# EasyEDA Pro project My_design_2025-04-12.epro

# Schematic Schematic1
Board Name: Board1; Create Date: 2025-04-12; Page Name: P1; Project Name: Pro1; Schematic Name: Schematic1; Update Date: 2025-04-12; Company: 嘉立创EDA; Page Size: A4; Version: V1.0
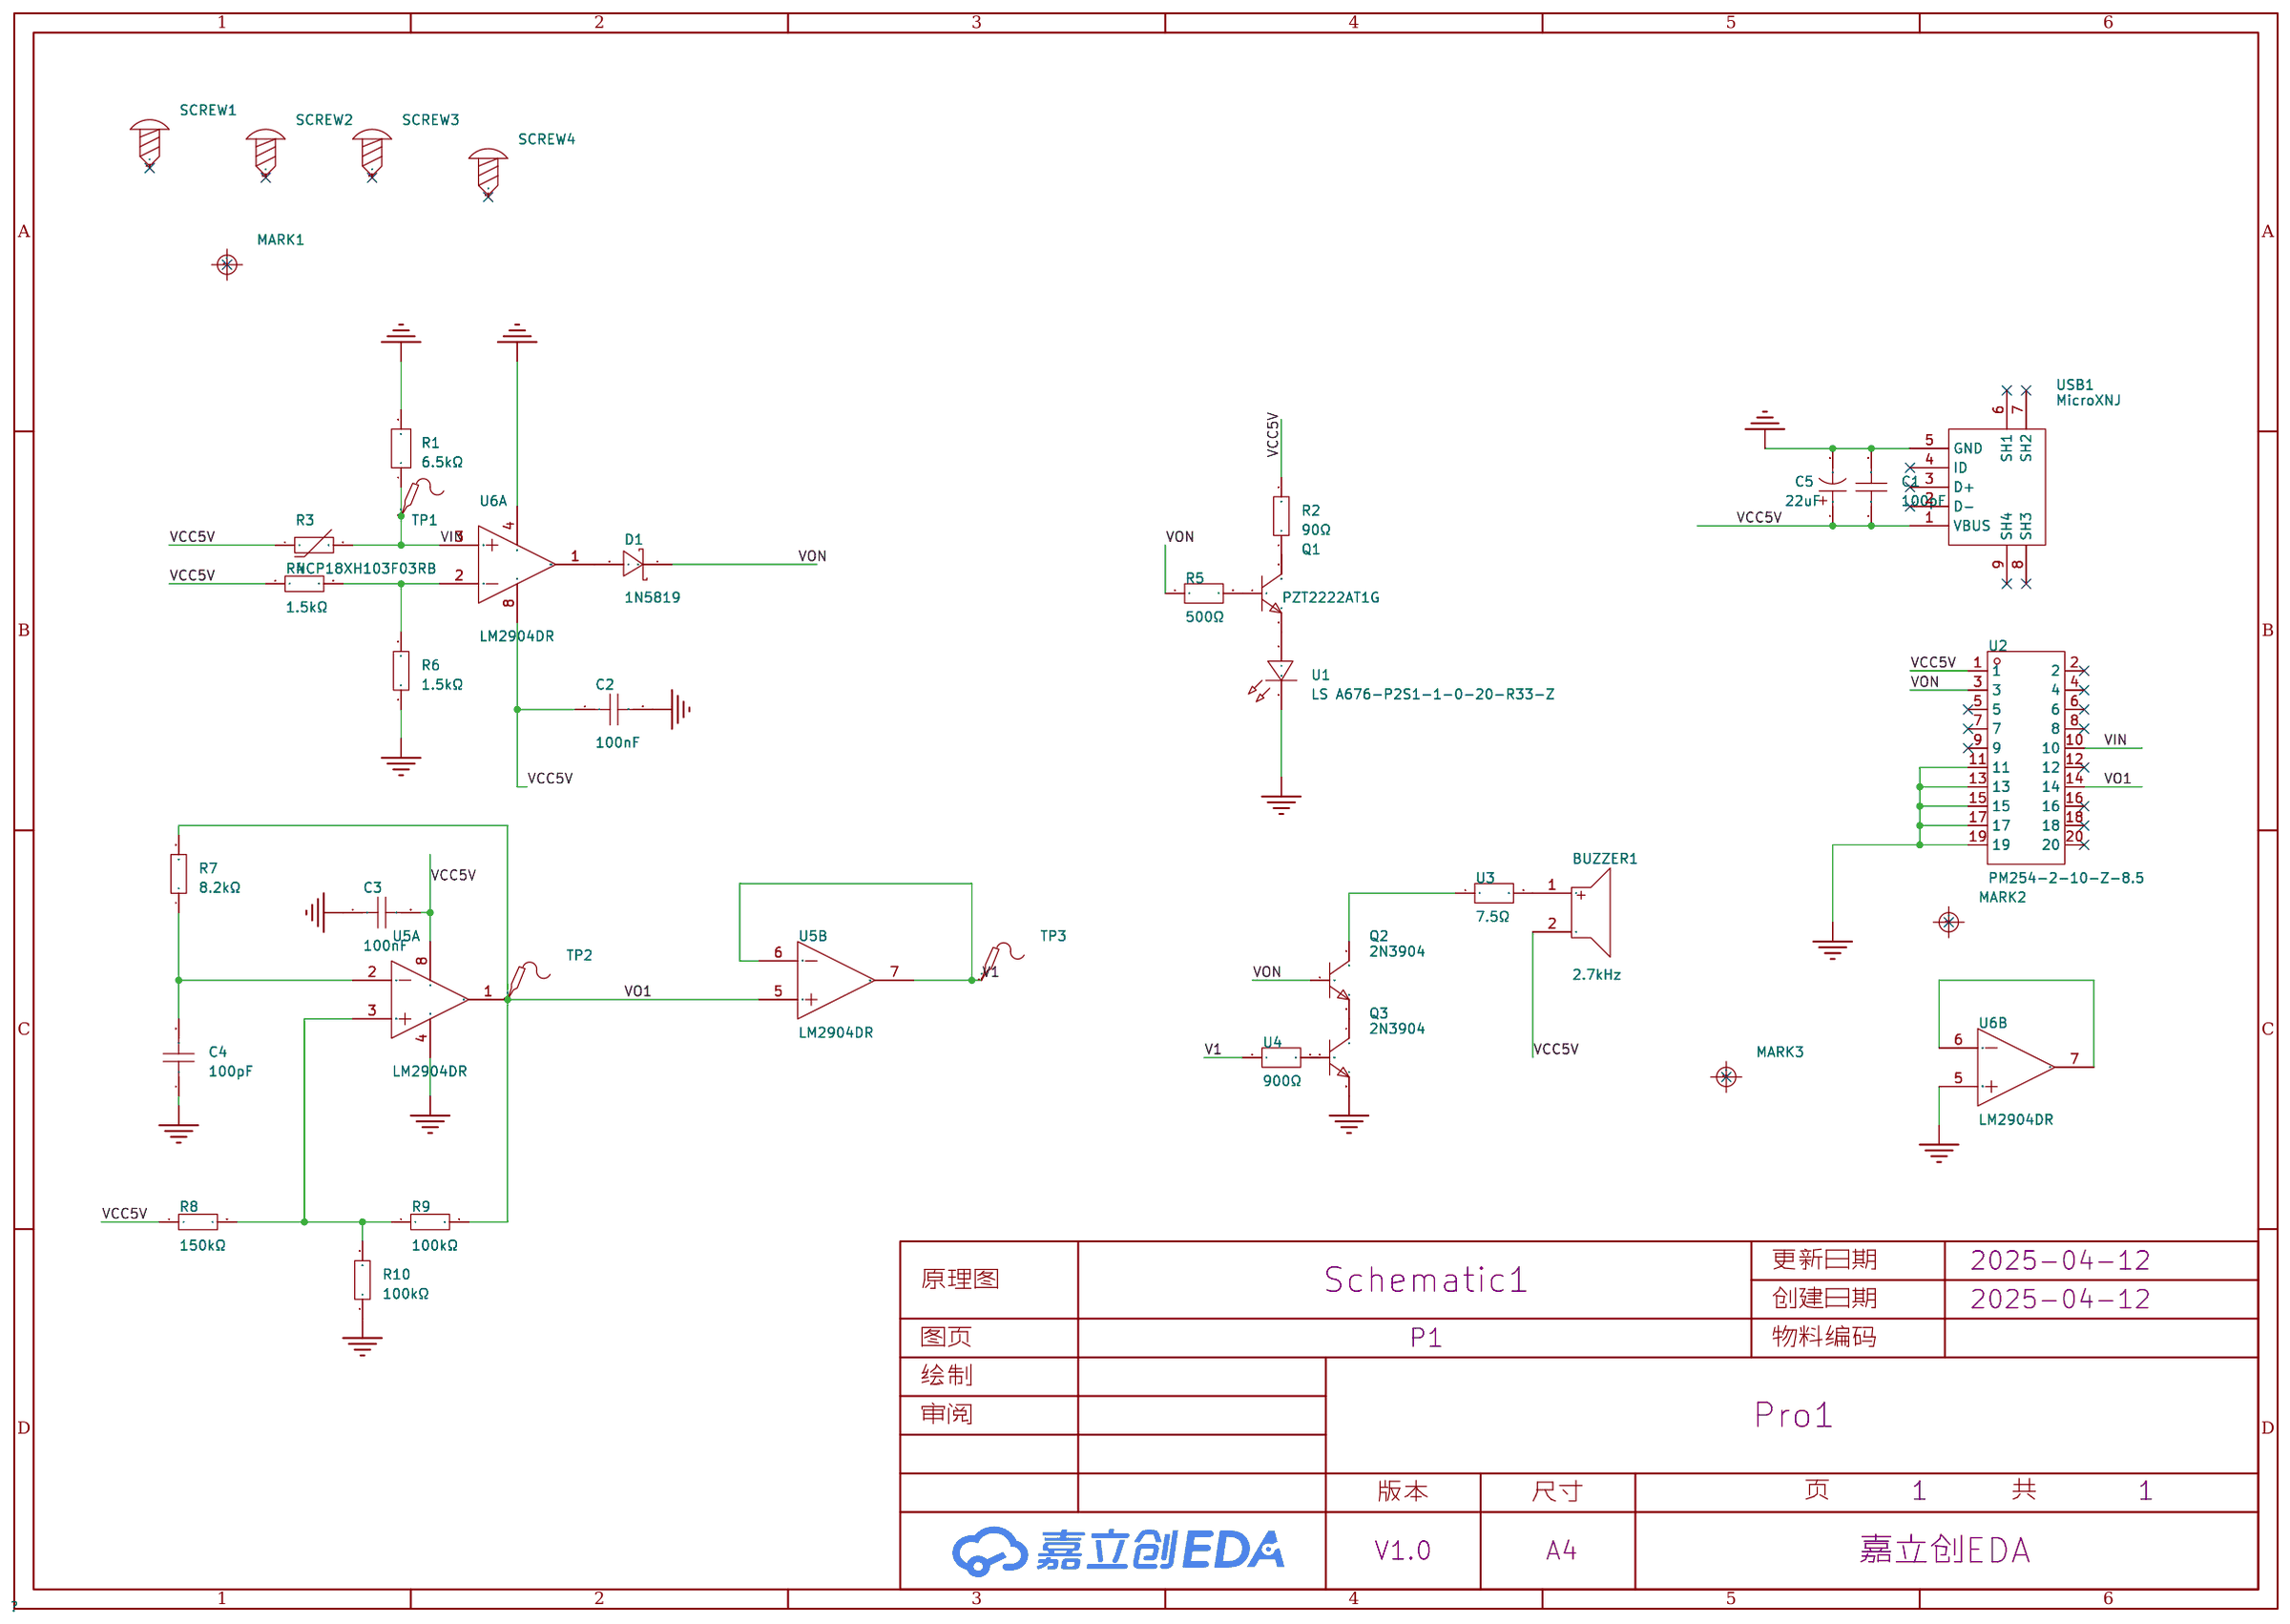
[diagram p0: schematic sheet]

## Parts
BUZZER1  2.7kHz  [BUZ-TH_BD9.0-P4.00-D0.6-FD]
C1  100pF  [C0603]
C2  100nF  [C0603]
C3  100nF  [C0603]
C4  100pF  [C0603]
C5  22uF  [CAP-TH_BD8.0-P5.00-D0.6-FD]
D1  1N5819  [SMA_L4.4-W2.6-LS5.0-RD]
MARK1  -  [Mark-Point-1mm]  (no BOM)
MARK2  -  [Mark-Point-1mm]  (no BOM)
MARK3  -  [Mark-Point-1mm]  (no BOM)
Q1  PZT2222AT1G  [SOT-223_L6.5-W3.5-P2.30-LS7.0-BR]
Q2  2N3904  [TO-92-3_L4.6-W3.6-P1.27-L_1]
Q3  2N3904  [TO-92-3_L4.6-W3.6-P1.27-L_1]
R1  6.5kΩ  [R0603]
R2  90Ω  [R0805]
R3  NCP18XH103F03RB  [R0603]
R4  1.5kΩ  [R0603]
R5  500Ω  [R0805]
R6  1.5kΩ  [R0603]
R7  8.2kΩ  [R0603]
R8  150kΩ  [R0603]
R9  100kΩ  [R0603]
R10  100kΩ  [R0603]
SCREW1  -  [M3螺丝]
SCREW2  -  [M3螺丝]
SCREW3  -  [M3螺丝]
SCREW4  -  [M3螺丝]
TP1  -  [Test-Point-0.5mm]
TP2  -  [Test-Point-0.5mm]
TP3  -  [Test-Point-0.5mm]
U1  LS A676-P2S1-1-0-20-R33-Z  [LED-SMD_L4.0-W3.6-P2.54-RD]
U2  PM254-2-10-Z-8.5  [HDR-TH_20P-P2.54-V-F-R2-C10-S2.54]
U3  7.5Ω  [R1206]
U4  900Ω  [R0805]
U5  LM2904DR  [SOIC-8_L4.9-W3.9-P1.27-LS6.0-BL]  (sections 1,2)
U6  LM2904DR  [SOIC-8_L4.9-W3.9-P1.27-LS6.0-BL]  (sections 1,2)
USB1  MicroXNJ  [MICRO-USB-SMD_MICROXNJ]

## Library data of the parts
BUZZER1 = QMB-09B-03: 驱动方式:无源(外部驱动);构造类型:电磁式;频率:2.7kHz;声压(SPL):85dB@3V,10cm;; LCSC Part Name: 无源蜂鸣器QMB-09B-03; Supplier Part: C96256; Manufacturer: 华能; Supplier Footprint: 插件,D=9mm; JLCPCB Part Class: 扩展库; Datasheet: https://atta.szlcsc.com/upload/public/pdf/source/20210401/C96256_958B17753B5AD7CBFBCFFC7C095B4484.pdf; Supplier: LCSC; Oscillator Circuit: 无源(外部驱动); Technology Type: 电磁式; Operating Voltage: 2V~5V; Sound Pressure Level (SPL): 85dB@3V,10cm; Diameter (φD): 9mm; Height: 5.7mm; Check: true
C1 C4 = CC0603JRNPO9BN101: 容值:100pF;精度:±5%;额定电压:50V;材质(温度系数):NP0;; LCSC Part Name: 100pF ±5% 50V; Supplier Part: C14665; Manufacturer: YAGEO(国巨); Supplier Footprint: 0603; JLCPCB Part Class: 扩展库; Datasheet: https://atta.szlcsc.com/upload/public/pdf/source/20181008/C309499_21CC21451B82C39E3D92150FD6B30293.pdf; Supplier: LCSC; Tolerance: ±5%; Voltage Rated: 50V; Temperature Coefficient: NP0; Check: true
C2 C3 = CC0603KRX7R9BB104: 容值:100nF;精度:±10%;额定电压:50V;材质(温度系数):X7R;; LCSC Part Name: 100nF ±10% 50V; Supplier Part: C14663; Manufacturer: YAGEO(国巨); Supplier Footprint: 0603; JLCPCB Part Class: 基础库; Datasheet: https://atta.szlcsc.com/upload/public/pdf/source/20180910/C282072_33301C7F631E79921B82A8DAC6BCC5B3.pdf; Supplier: LCSC; Tolerance: ±10%; Voltage Rated: 50V; Temperature Coefficient: X7R; Check: true
C5 = CD110226M2G0816VFL: 容值:22uF;额定电压:400V;; LCSC Part Name: 22uF 400V; Supplier Part: C7499973; Manufacturer: HRK(鸿瑞凯); Supplier Footprint: 插件,D8xL16mm; JLCPCB Part Class: 扩展库; Supplier: LCSC; Voltage Rated: 400V; Diameter: 8mm; Height - Seated (Max): 16mm
D1 = 1N5819_C437199: 正向压降(Vf):500mV@1A;直流反向耐压(Vr):40V;平均整流电流(Io):1A;; LCSC Part Name: 电压:40V 电流:1A; Supplier Part: C437199; Manufacturer: KEXIN(科信); Supplier Footprint: DO-214AC(SMA); JLCPCB Part Class: 扩展库; Datasheet: https://atta.szlcsc.com/upload/public/pdf/source/20191012/C437199_83583E622A6684E767605E43C169C596.pdf; Supplier: LCSC; Forward Voltage (Vf@If): 500mV@1A; Reverse Voltage (Vr): 40V; Average Rectified Current (Io): 1A; Check: true
MARK1-MARK3 = Mark-Point: Mark点; Check: true
Q1 = PZT2222AT1G: 晶体管类型:NPN;集电极电流(Ic):600mA;集射极击穿电压(Vceo):40V;功率(Pd):1.5W;直流电流增益(hFE@Ic,Vce):35@150mA,10V;; LCSC Part Name: NPN 电流:600mA 耐压:40V; Supplier Part: C115272; Manufacturer: onsemi(安森美); Supplier Footprint: SOT-223; JLCPCB Part Class: 扩展库; Datasheet: https://atta.szlcsc.com/upload/public/pdf/source/20181211/C115272_AD826A0F944780AAFC346C3EC86126BD.pdf; Supplier: LCSC; Transistor Type: NPN; Collector Current (Ic): 600mA; Collector-Emitter Breakdown Voltage (Vceo): 40V; Power Dissipation (Pd): 1.5W; DC Current Gain (hFE@Ic,Vce): 35@150mA,10V; Transition Frequency (fT): 300MHz; Collector Cut-Off Current (Icbo): 10nA; Collector-Emitter Saturation Voltage (VCE(sat)@Ic,Ib): 300mV@150mA,15mA; Operating Temperature: -55℃~+150℃
Q2 Q3 = 2N3904_C2874602: 晶体管类型:NPN;集电极电流(Ic):200mA;集射极击穿电压(Vceo):40V;功率(Pd):625mW;直流电流增益(hFE@Ic,Vce):10@10mA,1V;; LCSC Part Name: NPN 电流:200mA 耐压:40V; Supplier Part: C2874602; Manufacturer: JSMSEMI(杰盛微); Supplier Footprint: TO-92-3; JLCPCB Part Class: 扩展库; Datasheet: https://atta.szlcsc.com/upload/public/pdf/source/20240219/A8966BBAAB08D1F2F4DA71E9452FFE5E.pdf; Supplier: LCSC; Transistor Type: NPN; Collector Current (Ic): 200mA; Collector-Emitter Breakdown Voltage (Vceo): 40V; Power Dissipation (Pd): 625mW; DC Current Gain (hFE@Ic,Vce): 10@10mA,1V; Collector Cut-Off Current (Icbo): 100nA; Collector-Emitter Saturation Voltage (VCE(sat)@Ic,Ib): 300mV; Operating Temperature: -55℃~+150℃
R1 = MCT06030D6501BP100: 电阻类型:薄膜电阻;阻值:6.5kΩ;精度:±0.1%;功率:100mW;最大工作电压:75V;温度系数:±25ppm/℃;; LCSC Part Name: 薄膜电阻 6.5kΩ ±0.1% 100mW; Supplier Part: C1707189; Manufacturer: VISHAY(威世); Supplier Footprint: 0603; JLCPCB Part Class: 扩展库; Datasheet: https://atta.szlcsc.com/upload/public/pdf/source/20210426/0BE53C245AFBBB1DABBADD6CC4094FB0.pdf; Supplier: LCSC; Type: 薄膜电阻; Tolerance: ±0.1%; Power(Watts): 100mW; Overload Voltage (Max): 75V; Temperature Coefficient: ±25ppm/℃; Operating Temperature Range: -55℃~+125℃; Check: true
R2 = RS-05K90R0FT: 电阻类型:厚膜电阻;阻值:90Ω;精度:±1%;功率:125mW;最大工作电压:150V;温度系数:±100ppm/℃;; LCSC Part Name: 厚膜电阻 90Ω ±1% 125mW; Supplier Part: C320576; Manufacturer: FH(风华); Supplier Footprint: 0805; JLCPCB Part Class: 扩展库; Datasheet: https://atta.szlcsc.com/upload/public/pdf/source/20140616/1457707091974.pdf; Supplier: LCSC; Type: 厚膜电阻; Tolerance: ±1%; Power(Watts): 125mW; Overload Voltage (Max): 150V; Temperature Coefficient: ±100ppm/℃; Operating Temperature Range: -55℃~+155℃; Check: true
R3 = NCP18XH103F03RB: 阻值(25℃):10kΩ;B值(25℃/50℃):3380K;电阻精度:±1%;功率:100mW;B值精度:±1%;最大稳态电流(25℃):310uA;; LCSC Part Name: 10kΩ 电阻精度:±1% 3380K; Supplier Part: C13564; Manufacturer: muRata(村田); Supplier Footprint: 0603; JLCPCB Part Class: 扩展库; Datasheet: https://atta.szlcsc.com/upload/public/pdf/source/20130819/1457706638081.pdf; Supplier: LCSC; Resistance @ 25℃: 10kΩ; B Constant (25℃/50℃): 3380K; Resistance Tolerance: ±1%; B Constant (25℃/85℃): 3434K; B Constant (25℃/100℃): 3455K; Power: 100mW; B Constant Tolerance: ±1%; Steady State Current (Max): 310uA; Operating Temperature: -40℃~+125℃; Check: true
R4 R6 = 0603WAF1501T5E: 电阻类型:厚膜电阻;阻值:1.5kΩ;精度:±1%;功率:100mW;最大工作电压:75V;温度系数:±100ppm/℃;; LCSC Part Name: 1.5kΩ ±1% 100mW 厚膜电阻; Supplier Part: C22843; Manufacturer: UNI-ROYAL(厚声); Supplier Footprint: 0603; JLCPCB Part Class: 基础库; Datasheet: https://atta.szlcsc.com/upload/public/pdf/source/20200306/C422600_1E6D84923E4A46A82E41ADD87F860B5C.pdf; Supplier: LCSC; Type: 厚膜电阻; Tolerance: ±1%; Power(Watts): 100mW; Overload Voltage (Max): 75V; Temperature Coefficient: ±100ppm/℃; Operating Temperature Range: -55℃~+155℃; Check: true
R5 = ARG05FTC5000: 电阻类型:薄膜电阻;阻值:500Ω;精度:±1%;功率:125mW;最大工作电压:150V;温度系数:±25ppm/℃;; LCSC Part Name: 薄膜电阻 500Ω ±1% 125mW; Supplier Part: C2828857; Manufacturer: Viking(光颉); Supplier Footprint: 0805; JLCPCB Part Class: 扩展库; Datasheet: https://atta.szlcsc.com/upload/public/pdf/source/20210426/C2828737_35D2DDB0BDDA00747C2712435E28BBD4.pdf; Supplier: LCSC; Type: 薄膜电阻; Tolerance: ±1%; Power(Watts): 125mW; Overload Voltage (Max): 150V; Temperature Coefficient: ±25ppm/℃; Operating Temperature Range: -55℃~+155℃; Check: true
R7 = 0603WAF8201T5E: 电阻类型:厚膜电阻;阻值:8.2kΩ;精度:±1%;功率:100mW;最大工作电压:75V;温度系数:±100ppm/℃;; LCSC Part Name: 8.2kΩ ±1% 100mW 厚膜电阻; Supplier Part: C25981; Manufacturer: UNI-ROYAL(厚声); Supplier Footprint: 0603; JLCPCB Part Class: 基础库; Datasheet: https://atta.szlcsc.com/upload/public/pdf/source/20200306/C422600_1E6D84923E4A46A82E41ADD87F860B5C.pdf; Supplier: LCSC; Type: 厚膜电阻; Tolerance: ±1%; Power(Watts): 100mW; Overload Voltage (Max): 75V; Temperature Coefficient: ±100ppm/℃; Operating Temperature Range: -55℃~+155℃; Check: true
R8 = 0603WAF1503T5E: 电阻类型:厚膜电阻;阻值:150kΩ;精度:±1%;功率:100mW;最大工作电压:75V;温度系数:±100ppm/℃;; LCSC Part Name: 150kΩ ±1% 100mW 厚膜电阻; Supplier Part: C22807; Manufacturer: UNI-ROYAL(厚声); Supplier Footprint: 0603; JLCPCB Part Class: 基础库; Datasheet: https://atta.szlcsc.com/upload/public/pdf/source/20200306/C422600_1E6D84923E4A46A82E41ADD87F860B5C.pdf; Supplier: LCSC; Type: 厚膜电阻; Tolerance: ±1%; Power(Watts): 100mW; Overload Voltage (Max): 75V; Temperature Coefficient: ±100ppm/℃; Operating Temperature Range: -55℃~+155℃; Check: true
R9 R10 = 0603WAF1003T5E: 电阻类型:厚膜电阻;阻值:100kΩ;精度:±1%;功率:100mW;最大工作电压:75V;温度系数:±100ppm/℃;; LCSC Part Name: 100kΩ ±1% 100mW 厚膜电阻; Supplier Part: C25803; Manufacturer: UNI-ROYAL(厚声); Supplier Footprint: 0603; JLCPCB Part Class: 基础库; Datasheet: https://atta.szlcsc.com/upload/public/pdf/source/20200306/C422600_1E6D84923E4A46A82E41ADD87F860B5C.pdf; Supplier: LCSC; Type: 厚膜电阻; Tolerance: ±1%; Power(Watts): 100mW; Overload Voltage (Max): 75V; Temperature Coefficient: ±100ppm/℃; Operating Temperature Range: -55℃~+155℃; Check: true
SCREW1-SCREW4 = M3螺丝: Supplier Footprint: 插件; Check: true
TP1-TP3 = Test-Point: Test Point 测试点; Check: true
U1 = LS A676-P2S1-1-0-20-R33-Z: 发光颜色:红色;正向电压(VF):2V;功率:-;正向电流:20mA;主波长:633nm;二极管配置:-;透镜颜色:无色透明透镜;色温:-;发光强度:140mcd;发光角度:120°;载带方式:-;工作温度:-40℃~+100℃;; Supplier Part: C2830530; Manufacturer: OSRAM(欧司朗); Supplier Footprint: SMD,3.8x3.8mm; JLCPCB Part Class: 扩展库; Datasheet: https://atta.szlcsc.com/upload/public/pdf/source/20210520/C2830530_E9558D0B09993D0AFAFB2F579C8A98F9.pdf; Supplier: LCSC; Emitted Color: 红色; Forward Voltage (VF): 2V; Forward Current: 20mA; Dominant Wavelength: 633nm; Peak Wavelength: 645nm; Lens Color: 无色透明透镜; Luminous Intensity: 140mcd; Viewing Angle: 120°; Operating Temperature: -40℃~+100℃; Check: true
U2 = PM254-2-10-Z-8.5: 插孔结构:2x10P;间距:2.54mm;行距:2.54mm;圆孔/方孔:方孔;安装类型:直插;排数:双排;总孔位数:20P;额定电流:3A;额定电压:-;插孔方向:顶部;塑高:8.5mm;触头材质:铜合金;工作温度范围:-40℃~+105℃;焊接温度(最大值):260℃@5S;; LCSC Part Name: 2x10P 间距:2.54mm 直插; Supplier Part: C2897411; Manufacturer: HCTL(华灿天禄); Supplier Footprint: 插件,P=2.54mm; JLCPCB Part Class: 扩展库; Datasheet: https://atta.szlcsc.com/upload/public/pdf/source/20230609/3D36CA2C1BFC9FD1C3F709AD9DFEB9C2.pdf; Supplier: LCSC; Holes Structure: 2x10P; Pitch: 2.54mm; Row Spacing: 2.54mm; Circular Hole / Square Hole: 方孔; Mounting Type: 直插; Number of Rows: 双排; Number of Holes: 20P; Current Rating (Max): 3A; Holes Direction: 顶部; Insulation Height: 8.5mm; Contact Material: 铜合金; Operating Temperature Range: -40℃~+105℃; Soldering Temperature(Max): 260℃@5S; Check: true
U3 = FRC1206F7R50TS: 电阻类型:厚膜电阻;阻值:7.5Ω;精度:±1%;功率:250mW;最大工作电压:200V;温度系数:±200ppm/℃;; LCSC Part Name: 7.5Ω ±1% 250mW 厚膜电阻; Supplier Part: C2933756; Manufacturer: FOJAN(富捷); Supplier Footprint: 1206; JLCPCB Part Class: 扩展库; Datasheet: https://atta.szlcsc.com/upload/public/pdf/source/20211221/925EC7D7225764EE0046F22065062C87.pdf; Supplier: LCSC; Type: 厚膜电阻; Tolerance: ±1%; Power(Watts): 250mW; Overload Voltage (Max): 200V; Temperature Coefficient: ±200ppm/℃; Operating Temperature Range: -55℃~+155℃; Check: true
U4 = ARG05BTC9000N: 电阻类型:薄膜电阻;阻值:900Ω;精度:±0.1%;功率:125mW;最大工作电压:150V;温度系数:±25ppm/℃;; LCSC Part Name: 薄膜电阻 900Ω ±0.1% 125mW; Supplier Part: C2828704; Manufacturer: Viking(光颉); Supplier Footprint: 0805; JLCPCB Part Class: 扩展库; Datasheet: https://atta.szlcsc.com/upload/public/pdf/source/20190816/C412422_E173BA386C6DD8245B6A88358EF9877A.pdf; Supplier: LCSC; Type: 薄膜电阻; Tolerance: ±0.1%; Power(Watts): 125mW; Overload Voltage (Max): 150V; Temperature Coefficient: ±25ppm/℃; Operating Temperature Range: -55℃~+155℃; Check: true
U5 U6 = LM2904DR_C7934: 放大器数:双路;增益带宽积(GBP):700kHz;输入偏置电流(Ib):20nA;压摆率(SR):0.3V/us;带宽(-3db):-;; LCSC Part Name: 行业标准双路运算放大器; Supplier Part: C7934; Manufacturer: TI(德州仪器); Supplier Footprint: SOIC-8; JLCPCB Part Class: 扩展库; Datasheet: http://www.ti.com/cn/lit/gpn/lm358; Supplier: LCSC; Number of Circuits: 双路; Gain Bandwidth Product(GBP): 700kHz; Current - Input Bias(Ib): 20nA; Slew Rate(SR): 0.3V/us; Output Current: 40mA; Supply Current: 1mA; Operating Temperature: -40℃~+125℃; Check: true
USB1 = MicroXNJ: 连接器类型:Micro-B;标准:USB 2.0;公母:母;安装方式:卧贴;触点数量:5P;端口数量:1;额定电流 - 电源:1A;工作温度范围:-20℃~+85℃;; LCSC Part Name: Micro-B 母 卧贴; Supplier Part: C404969; Manufacturer: SHOU HAN(首韩); Supplier Footprint: SMD; JLCPCB Part Class: 扩展库; Datasheet: https://atta.szlcsc.com/upload/public/pdf/source/20220415/2494EDFF499AF6F852F7C820374B6AF3.pdf; Supplier: LCSC; Connector Type: Micro-B; Standard: USB 2.0; Gender: 母; Mounting Style: 卧贴; Number of Contacts: 5P; Number of Ports: 1; Current Rating - Power (Max): 1A; Operating Temperature Range: -20℃~+85℃; Check: true

## Nets
GND: C1.2 C2.2 C3.1 C4.1 C5.2 Q3.3(E) R1.2 R6.1 R10.1 U1.1(C) U2.11 U2.13 U2.15 U2.17 U2.19 U5.4(GND) U6.4(GND) U6.5(2IN+) USB1.5(GND)
V1: TP3.1 U4.1 U5.6(2IN-) U5.7(2OUT)
VCC5V: BUZZER1.2 C1.1 C2.1 C3.2 C5.1 R2.2 R3.1 R4.1 R8.1 U2.1 U5.8(VCC) U6.8(VCC) USB1.1(VBUS)
VIN: R1.1 R3.2 TP1.1 U2.10 U6.3(1IN+)
VO1: R7.2 R9.2 TP2.1 U2.14 U5.1(1OUT) U5.5(2IN+)
VON: D1.1(C) Q2.2(B) R5.1 U2.3
Net-(BUZZER1-1): BUZZER1.1 U3.2
Net-(C4-2): C4.2 R7.1 U5.2(1IN-)
Net-(D1-2): D1.2(A) U6.1(1OUT)
Net-(Q1-1): Q1.1(B) R5.2
Net-(Q1-2): Q1.2(C) Q1.4(C) R2.1
Net-(Q1-3): Q1.3(E) U1.2(A)
Net-(Q2-1): Q2.1(C) U3.1
Net-(Q2-3): Q2.3(E) Q3.1(C)
Net-(Q3-2): Q3.2(B) U4.2
Net-(R4-2): R4.2 R6.2 U6.2(1IN-)
Net-(R8-2): R8.2 R9.1 R10.2 U5.3(1IN+)
Net-(U6-6): U6.6(2IN-) U6.7(2OUT)

Not connected (* = marked no-connect by the designer): MARK1 1*; MARK2 1*; MARK3 1*; SCREW1 1*; SCREW2 1*; SCREW3 1*; SCREW4 1*; U2 2* 4* 5* 6* 7* 8* 9* 12* 16* 18* 20*; USB1 2(D-)* 3(D+)* 4(ID)* 6(SH1)* 7(SH2)* 8(SH3)* 9(SH4)*

# Board PCB1
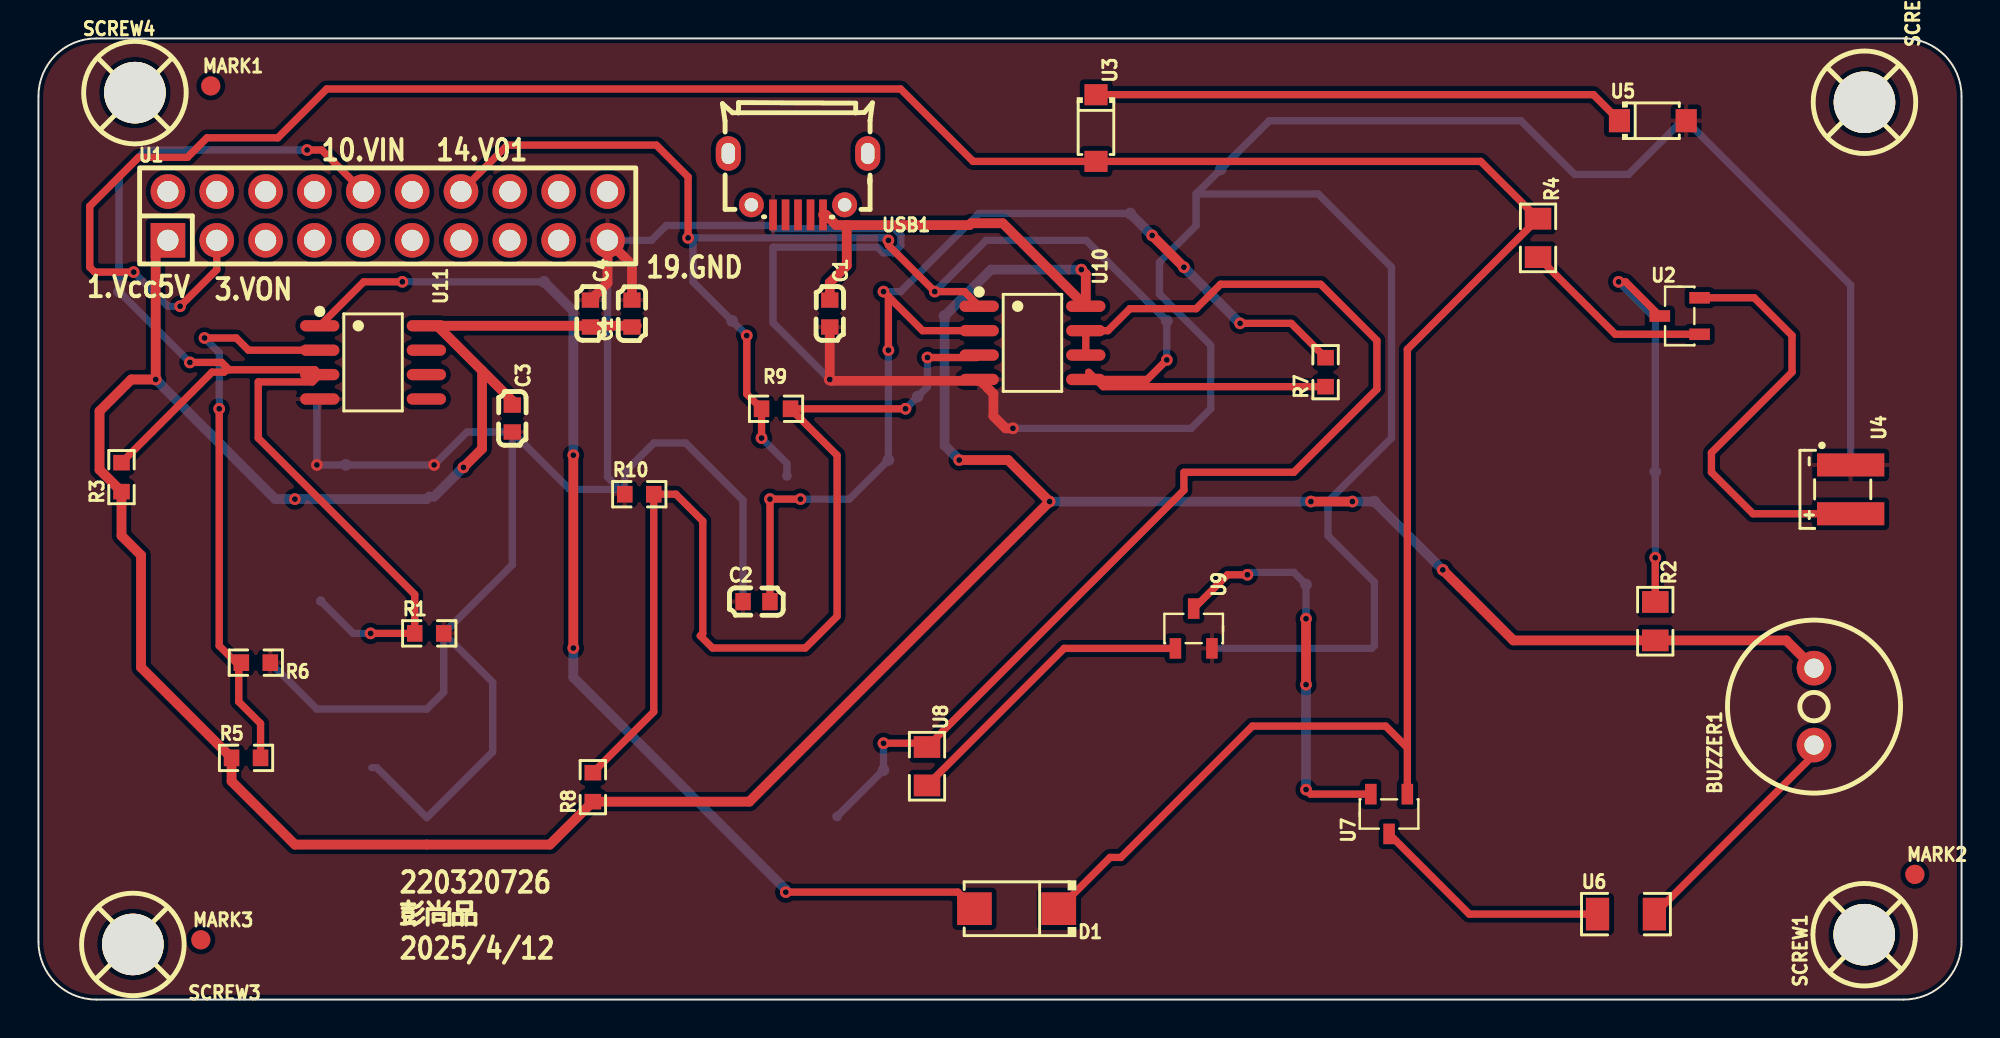
[diagram p1: board, top side]
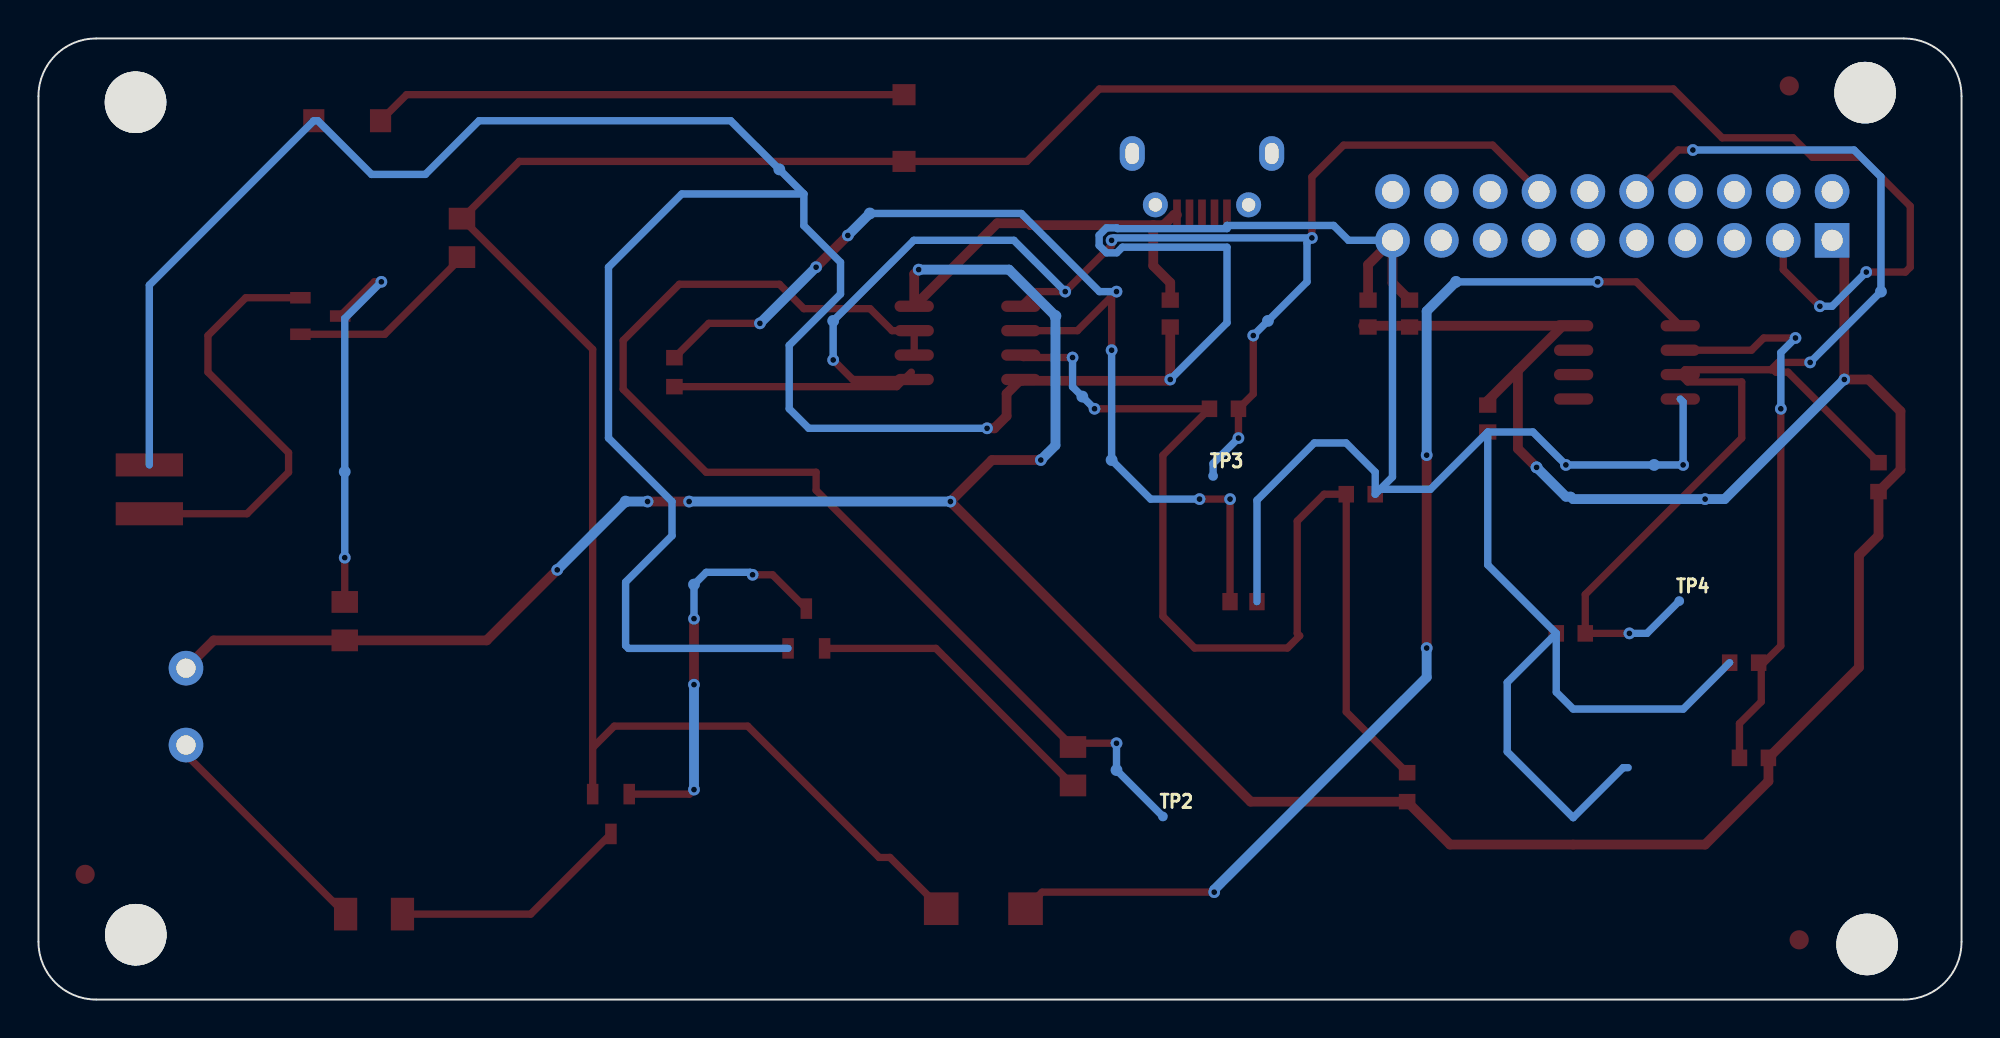
[diagram p2: board, bottom side, seen from below]

Outline 100 x 50 mm; copper layers: Top Layer, Bottom Layer. Coordinates in mm from the lower left corner of the outline.
Outline path: 0,47 0,3 arc(0.88,0.88) 3,0 97,0 arc(99.12,0.88) 100,3 100,47 arc(99.12,49.12) 97,50 3,50 arc(0.88,49.12) 0,47
Stack: Top Layer 0.035mm / Dielectric1 1.51mm FR4 er 4.5 / Bottom Layer 0.035mm

## Design rules (mm)
template: JLCPCB Capability(Two Layers Board)
spacing copperThickness1oz (default): track to track 0.102, other pairs 0.152 to 0.3
spacing copperThickness2oz: track to track 0.203, other pairs 0.152 to 0.3
track width copperThickness1oz (default): min 0.127, default 0.254, max 2.54
track width copperThickness2oz: min 0.203, default 0.254, max 2.54
differential pair differentialPair (default): width min 0.127, default 0.254, max 2.54; gap min 0.152, default 0.152
via viaSize (default): diameter min 0.5, default 0.61, max 10; hole min 0.3, default 0.305, max 6.3

## Placement (name value [footprint] x y rotation side)
BUZZER1  2.7kHz  [BUZ-TH_BD9.0-P4.00-D0.6-FD]  92.33 15.24 90 top
C1  100pF  [C0603]  41.15 35.69 270 top
C1#2  -  [C0603]  30.86 35.69 90 top
C2  100nF  [C0603]  37.34 20.7 0 top
C3  100nF  [C0603]  24.64 30.23 270 top
C4  100pF  [C0603]  28.7 35.69 270 top
D1  1N5819  [SMA_L4.4-W2.6-LS5.0-RD]  50.86 4.73 180 top
MARK1  -  [Mark-Point-1mm]  8.96 47.53 0 top
MARK2  -  [Mark-Point-1mm]  97.57 6.51 0 top
MARK3  -  [Mark-Point-1mm]  8.44 3.11 0 top
NOREF  -  [Pad_e815]  43.94 11.94 0 top
NOREF#2  -  [Pad_e796]  69.47 25.91 0 top
NOREF#3  -  [Pad_e797]  65.91 21.59 0 top
NOREF#4  -  [Pad_e3083]  15.98 27.81 0 top
NOREF#5  -  [Pad_e787]  56.77 40.89 0 top
NOREF#6  -  [Pad_e808]  45.72 31.37 0 top
NOREF#7  -  [Pad_e794]  44.2 28.07 0 top
NOREF#8  -  [Pad_e788]  36.07 35.31 0 top
NOREF#9  -  [Pad_e786]  22.1 27.69 0 top
NOREF#10  -  [Pad_e784]  4.19 36.83 0 top
NOREF#11  -  [Pad_e809]  61.47 43.19 0 top
NOREF#12  -  [Pad_e807]  47.12 35.56 0 top
NOREF#13  -  [Pad_e795]  58.67 35.31 0 top
NOREF#14  -  [Pad_e785]  26.29 37.34 0 top
NOREF#15  -  [Pad_e798]  84.07 27.46 0 top
R1  6.5kΩ  [R0603]  20.32 19.05 0 top
R2  90Ω  [R0805]  84.07 19.69 270 top
R3  NCP18XH103F03RB  [R0603]  4.32 27.18 90 top
R4  1.5kΩ  [R0805]  77.98 39.62 270 top
R5  500Ω  [R0603]  10.8 12.57 0 top
R6  1.5kΩ  [R0603]  11.3 17.53 180 top
R7  8.2kΩ  [R0603]  66.93 32.64 90 top
R8  150kΩ  [R0603]  28.83 11.05 90 top
R9  100kΩ  [R0603]  38.35 30.73 180 top
R10  100kΩ  [R0603]  31.24 26.29 0 top
SCREW1  -  [M3螺丝]  95 3.44 90 top
SCREW2  -  [M3螺丝]  94.89 46.62 270 top
SCREW3  -  [M3螺丝]  4.85 2.93 180 top
SCREW4  -  [M3螺丝]  5.08 47.12 0 top
TP2  -  [Test-Point-0.5mm]  41.53 9.53 180 bottom
TP3  -  [Test-Point-0.5mm]  38.92 27.24 180 bottom
TP4  -  [Test-Point-0.5mm]  14.68 20.73 180 bottom
U1  LS A676-P2S1-1-0-20-R33-Z  [HDR-TH_20P-P2.54-V-F-R2-C10-S2.54]  18.16 40.77 0 top
U2  PM254-2-10-Z-8.5  [SOT-23-3_L2.9-W1.4-P1.90-LS2.5-BR]  85.34 35.56 0 top
U3  7.5Ω  [SOD-123_L2.7-W1.6-LS3.8-RD]  54.99 45.34 270 top
U4  900Ω  [LED-SMD_L4.0-W3.6-P2.54-RD]  94.23 26.54 270 top
U5  LM2904DR  [SOD-123_L2.7-W1.6-LS3.8-RD]  83.95 45.72 0 top
U6  LM2904DR  [R1206]  82.55 4.45 0 top
U7  2N5551  [SOT-23-3_L2.9-W1.4-P1.90-LS2.5-BR]  70.23 9.65 90 top
U8  900Ω  [R0805]  46.2 12.14 270 top
U9  2N5551  [SOT-23-3_L2.9-W1.4-P1.90-LS2.5-BR]  60.07 19.3 270 top
U10  LM2904DR  [SOIC-8_L4.9-W3.9-P1.27-LS6.0-BL]  51.69 34.16 270 top
U11  LM2904DR  [SOIC-8_L4.9-W3.9-P1.27-LS6.0-BL]  17.4 33.15 270 top
USB1  MicroXNJ  [MICRO-USB-SMD_MICROXNJ]  39.5 42.42 180 top

## Footprints (pads in the part's own frame, mm; a bottom-side part is the same pattern mirrored in y, then rotated)
BUZ-TH_BD9.0-P4.00-D0.6-FD
  round 1.8 hole 1: 1(-2,0) 2(2,0)
C0603
  rect 0.8x0.9 smd: 1(-0.7,0) 2(0.7,0)
HDR-TH_20P-P2.54-V-F-R2-C10-S2.54
  rect 1.8x1.8 hole 1.1: 1(-11.43,-1.27)
  round 1.8 hole 1.1: 2(-11.43,1.27) 3(-8.89,-1.27) 4(-8.89,1.27) 5(-6.35,-1.27) 6(-6.35,1.27) 7(-3.81,-1.27) 8(-3.81,1.27) 9(-1.27,-1.27) 10(-1.27,1.27) 11(1.27,-1.27) 12(1.27,1.27) 13(3.81,-1.27) 14(3.81,1.27) 15(6.35,-1.27) 16(6.35,1.27) 17(8.89,-1.27) 18(8.89,1.27) 19(11.43,-1.27) 20(11.43,1.27)
LED-SMD_L4.0-W3.6-P2.54-RD
  rect 1.2x3.5 smd: 1(-1.27,0) 2(1.27,0)
M3螺丝
  round 3.2 hole 3.2: 1(-0.064,0.064)
Mark-Point-1mm
  round 1 smd: 1(0,0)
MICRO-USB-SMD_MICROXNJ
  rect 0.4x1.6 smd: 1(-1.3,1.597) 2(-0.65,1.597) 3(0,1.597) 4(0.65,1.597) 5(1.3,1.597)
  round 1.3 hole 0.7: 6(2.425,1.074) 9(-2.425,1.073)
  oval 1.3x1.8 hole 0.7x1.1: 7(3.625,-1.597) 8(-3.625,-1.597)
Pad_e784
  round 0.61 smd far side: TP1(0,0)
Pad_e785
  round 0.61 smd far side: TP2(0,0)
Pad_e786
  round 0.61 smd far side: TP3(0,0)
Pad_e787
  round 0.61 smd far side: TP4(0,0)
Pad_e788
  round 0.61 smd far side: TP5(0,0)
Pad_e794
  round 0.61 smd far side: TP6(0,0)
Pad_e795
  round 0.61 smd far side: TP7(0,0)
Pad_e796
  round 0.61 smd far side: TP8(0,0)
Pad_e797
  round 0.61 smd far side: TP1(0,0)
Pad_e798
  round 0.61 smd far side: TP10(0,0)
Pad_e807
  round 0.61 smd far side: TP11(0,0)
Pad_e808
  round 0.61 smd far side: TP12(0,0)
Pad_e809
  round 0.61 smd far side: TP13(0,0)
Pad_e815
  round 0.61 smd far side: TP14(0,0)
Pad_e3083
  round 0.61 smd far side: TP15(0,0)
R0603
  rect 0.806x0.864 smd: 1(-0.753,0) 2(0.753,0)
R0805
  rect 1.133x1.377 smd: 1(-1,0) 2(1,0)
R1206
  rect 1.208x1.701 smd: 1(-1.479,0) 2(1.479,0)
SMA_L4.4-W2.6-LS5.0-RD
  rect 1.8x1.7 smd: 1(-2.192,0) 2(2.192,0)
SOD-123_L2.7-W1.6-LS3.8-RD
  rect 1.1x1.2 smd: 1(-1.735,0) 2(1.735,0)
SOIC-8_L4.9-W3.9-P1.27-LS6.0-BL
  oval 0.588x2.045 smd: 1(-1.905,-2.772) 2(-0.635,-2.772) 3(0.635,-2.772) 4(1.905,-2.772) 5(1.905,2.772) 6(0.635,2.772) 7(-0.635,2.772) 8(-1.905,2.772)
SOT-23-3_L2.9-W1.4-P1.90-LS2.5-BR
  rect 1.07x0.6 smd: 1(1.035,-0.95) 2(1.035,0.95) 3(-1.035,0)
Test-Point-0.5mm
  round 0.5 smd: 1(0,0)

## Nets
GND: C1.2 C1#2.2 C2.1 C3.2 C4.1 NOREF#4.TP15 NOREF#11.TP13 R1.2 R6.1 R10.1 U1.19 U4.1 U5.2 U9.2 U10.4 U11.4 USB1.5
VCC5V: BUZZER1.2 C1.1 C1#2.1 C3.1 C4.2 NOREF#2.TP8 NOREF#9.TP3 NOREF#12.TP11 R2.2 R3.1 R5.1 R8.1 U1.1 U10.8 U11.8 USB1.1
VIN: NOREF#10.TP1 R1.1 R3.2 TP4.1 U1.10 U11.3
VO1: NOREF#8.TP5 NOREF#13.TP7 R7.1 R9.2 TP3.1 U1.14 U10.1 U10.5
VON: D1.1 R4.1 U1.3 U3.2 U7.1
$1N1134: U3.1 U5.1
$1N1559: R4.2 U2.1
$1N1638: U2.2 U4.2
$1N1768: NOREF#15.TP10 R2.1 U2.3
$1N1930: R5.2 R6.2 U11.2
$1N2911: NOREF.TP14 TP2.1 U8.1 U10.6 U10.7
$1N3068: NOREF#3.TP1 U7.2 U9.3
$1N3088: U6.1 U7.3
$1N3167: U8.2 U9.1
$1N3294: BUZZER1.1 U6.2
$1N3653: C2.2 NOREF#5.TP4 NOREF#7.TP6 R7.2 U10.2
$1N3786: NOREF#6.TP12 R8.2 R9.1 R10.2 U10.3
$1N4632: D1.2 NOREF#14.TP2 U11.1

Pads without a net: MARK1 1; MARK2 1; MARK3 1; SCREW1 1; SCREW2 1; SCREW3 1; SCREW4 1; U1 2 4 5 6 7 8 9 11 12 13 15 16 17 18 20; U11 5 6 7; USB1 2 3 4 6 7 8 9

## Via types
v1: diameter 0.61, hole 0.305, Top Layer to Bottom Layer, 46 vias

## Routing (per net, layer and track width the routed paths; a pad name or vN(x,y) marks a point on that pad's centre or on a via; arc(x,y) is an arc through that point)
GND: length 260.1
  Top Layer w0.508: C1#2.2 30.86,38.23 U1.19 29.59,37.28 C4.1 ; C1.2 v1(41.15,32.26) 41.22,32.19 48.85,32.19 U10.4 49.66,31.52 49.66,30.35 50.29,29.72 v1(50.67,29.72)
  Bottom Layer w0.381: U4.1 94.23,37.17 U5.2 85.47,45.72 82.68,42.93 79.88,42.93 77.09,45.72 64.01,45.72 NOREF#11.TP13 60.2,41.91 ; 17.34,12.06 17.59,12.06 20.19,9.46 23.62,12.89 23.62,16.5 R1.2 ; 36.64,20.7 36.64,25.97 33.65,28.96 32,28.96 30.49,27.44 R10.1 30.23,26.54 ; 30.23,26.54 27.62,26.54 C3.2 ; 30.23,26.54 29.59,27.19 U1.19 31.88,39.5 32.65,40.27 38.2,40.27 38.2,40.11 43.89,40.11 43.93,40.14 44.46,40.14 44.84,39.77 44.84,39.23 44.46,38.85 43.93,38.85 43.64,39.14 38.2,39.14 38.2,35.21 v1(41.15,32.26) ; v1(50.67,29.72) 59.94,29.72 60.96,30.73 60.96,34.04 58.29,36.7 58.29,38.35 60.2,40.26 60.2,41.91 ; R1.2 21.07,15.99 20.19,15.11 14.47,15.11 R6.1 ; R1.2 24.64,22.61 C3.2 ; C3.2 22.29,29.53 v1(20.57,27.81) NOREF#4.TP15 v1(14.48,27.81) 14.48,31.09 U11.4 ; 60.2,41.91 66.55,41.91 70.36,38.1 70.36,29.21 67.06,25.91 67.06,24.13 69.47,21.72 69.47,18.42 69.32,18.27 U9.2
VCC5V: length 211.6
  Top Layer w0.381: 20.51,35.05 20.49,35.07 20.17,35.07 U11.8
  Top Layer w0.508: v1(68.33,25.91) v1(66.17,25.91) ; 42.03,40.29 48.42,40.29 48.51,40.39 50.14,40.39 U10.8 54.46,37.74 v1(54.23,37.97) ; 42.03,40.29 42.03,38.18 41.15,37.3 C1.1 ; 42.03,40.29 41.48,40.29 40.95,40.82 USB1.1 ; C3.1 24.64,31.15 23.07,32.72 ; 31.11,35.05 20.74,35.05 ; 20.74,35.05 23.07,32.72 ; 20.74,35.05 20.51,35.05 ; 23.07,32.72 23.07,28.66 v1(22.1,27.69) ; 6.1,38.61 v1(6.1,32.26) 4.83,32.26 3.17,30.61 3.17,27.57 R3.1 4.32,24.13 5.33,23.11 5.33,17.28 R5.1 10.04,11.36 13.33,8.06 26.6,8.06 R8.1 36.97,10.3 v1(52.58,25.91) 50.42,28.07 v1(47.88,28.07) ; v1(73.02,22.35) 76.69,18.69 R2.2 90.88,18.69 BUZZER1.2
  Bottom Layer w0.508: v1(6.1,32.26) 12.32,26.03 v1(13.33,26.03) 20.19,26.03 20.32,26.16 20.57,26.16 v1(22.1,27.69) ; v1(73.02,22.35) NOREF#2.TP8 v1(68.33,25.91) ; v1(54.23,37.97) 49.53,37.97 NOREF#12.TP11 47.12,28.83 v1(47.88,28.07) ; v1(52.58,25.91) v1(66.17,25.91)
VIN: length 65.3
  Top Layer w0.381: v1(17.27,19.05) R1.1 19.57,21.07 11.43,29.21 11.43,32.13 14.25,32.13 U11.3 14.37,32.77 9.91,32.77 ; 9.91,32.77 9.78,32.77 9.65,32.64 9.03,32.64 R3.2 ; 9.91,32.77 9.53,33.15 v1(7.87,33.15) ; U1.10 14.73,44.2 v1(13.97,44.2)
  Bottom Layer w0.381: TP4.1 16.36,19.05 v1(17.27,19.05) ; v1(13.97,44.2) 5.59,44.2 4.19,42.8 NOREF#10.TP1 v1(7.87,33.15)
VO1: length 82.1
  Top Layer w0.381: 54.99,32.26 55.36,31.89 R7.1 ; 54.99,32.26 57.66,32.26 v1(58.67,33.27) ; 54.99,32.26 U10.5 ; 54.99,32.26 54.61,32.64 ; v1(37.6,29.21) R9.2 36.83,31.5 v1(36.83,34.54) ; v1(44.2,39.5) 44.2,39.24 v1(46.61,36.83) 48.15,36.83 U10.1 ; v1(33.78,39.62) 33.78,42.8 32.13,44.45 24.38,44.45 U1.14
  Bottom Layer w0.381: v1(36.83,34.54) NOREF#8.TP5 34.04,37.34 34.04,39.37 v1(33.78,39.62) 44.07,39.62 v1(44.2,39.5) ; v1(58.67,33.27) NOREF#13.TP7 54.48,39.5 49.28,39.5 v1(46.61,36.83) ; TP3.1 38.92,27.89 v1(37.6,29.21)
VON: length 148.8
  Top Layer w0.381: 71.18,13.1 70.06,14.22 63.12,14.22 56.29,7.39 55.72,7.39 D1.1 ; 71.18,13.1 U7.1 ; 71.18,13.1 71.18,33.83 R4.1 75,43.6 U3.2 48.6,43.6 44.83,47.37 14.99,47.37 12.45,44.83 8.76,44.83 7.75,43.81 5.21,43.81 2.67,41.28 2.67,38.1 2.92,37.85 v1(4.95,37.85) ; U1.3 9.27,37.97 v1(7.37,36.07)
  Bottom Layer w0.381: v1(4.95,37.85) 6.73,36.07 v1(7.37,36.07)
$1N1134: length 27.8
  Top Layer w0.381: U3.1 80.86,47.07 82.21,45.72
$1N1559: length 10.1
  Top Layer w0.381: U2.1 81.99,34.61 R4.2
$1N1638: length 22.6
  Top Layer w0.381: U4.2 89.15,25.27 86.99,27.43 86.99,28.45 91.19,32.64 91.19,34.54 89.22,36.51 U2.2
$1N1768: length 20.3
  Top Layer w0.381: U2.3 82.53,37.34 v1(82.17,37.34) ; R2.1 v1(84.07,22.99)
  Bottom Layer w0.381: v1(84.07,22.99) NOREF#15.TP10 84.07,35.43 v1(82.17,37.34)
$1N1930: length 29.5
  Top Layer w0.381: v1(8.64,34.42) 10.29,34.42 10.92,33.78 14.63,33.78 ; 10.41,17.39 10.41,15.49 11.55,14.36 R5.2 ; 10.41,17.39 9.4,18.41 v1(9.4,30.73) ; 10.41,17.39 R6.2
  Bottom Layer w0.381: v1(9.4,30.73) 9.4,33.66 v1(8.64,34.42)
$1N2911: length 60
  Top Layer w0.381: v1(43.94,13.34) 46.01,13.34 U8.1 59.56,26.5 59.56,27.43 65.28,27.43 69.6,31.75 69.6,34.29 66.67,37.21 61.47,37.21 60.2,35.94 56.75,35.94 55.61,34.8 U10.7 54.46,33.53
  Bottom Layer w0.381: TP2.1 NOREF.TP14 v1(43.94,13.34)
$1N3068: length 21
  Top Layer w0.381: v1(65.91,10.92) 66.15,10.69 U7.2 ; v1(62.86,22.1) 61.83,22.1 U9.3
  Top Layer w0.508: v1(65.91,19.81) v1(65.91,16.38)
  Bottom Layer w0.381: v1(65.91,19.81) NOREF#3.TP1 65.28,22.22 62.99,22.22 v1(62.86,22.1)
  Bottom Layer w0.508: v1(65.91,10.92) v1(65.91,16.38)
$1N3088: length 12.6
  Top Layer w0.381: U6.1 74.4,4.45 U7.3
$1N3167: length 15.9
  Top Layer w0.381: U8.2 53.33,18.27 U9.1
$1N3294: length 12.2
  Top Layer w0.381: BUZZER1.1 92.33,12.75 U6.2
$1N3653: length 54.4
  Top Layer w0.381: 44.2,36.58 45.97,34.8 U10.2 ; 44.2,36.58 v1(43.94,36.83) ; 44.2,36.58 v1(44.2,33.78) ; R7.2 65.14,35.18 v1(62.48,35.18) ; v1(39.62,26.03) v1(38.04,26.03) C2.2
  Top Layer w0.508: v1(57.91,39.75) v1(59.56,38.1)
  Bottom Layer w0.381: NOREF#5.TP4 48.89,40.89 44.83,36.83 v1(43.94,36.83) ; v1(39.62,26.03) 42.16,26.03 NOREF#7.TP6 v1(44.2,33.78)
  Bottom Layer w0.508: v1(59.56,38.1) v1(62.48,35.18) ; NOREF#5.TP4 v1(57.91,39.75)
$1N3786: length 56.7
  Top Layer w0.381: v1(45.08,30.73) R9.1 41.53,28.31 41.53,19.94 39.88,18.29 35.05,18.29 34.42,18.92 34.54,19.05 34.54,24.89 33.15,26.29 R10.2 32,14.97 R8.2 ; 48.92,33.53 48.79,33.4 v1(46.23,33.4)
  Bottom Layer w0.381: v1(46.23,33.4) 46.23,31.88 NOREF#6.TP12 v1(45.08,30.73)
$1N4632: length 59.7
  Top Layer w0.381: v1(38.86,5.59) 47.81,5.59 D1.2 ; U11.1 16.91,37.34 v1(18.92,37.34)
  Top Layer w0.508: v1(27.81,28.32) v1(27.81,18.29)
  Bottom Layer w0.381: NOREF#14.TP2 v1(18.92,37.34)
  Bottom Layer w0.508: v1(38.86,5.59) 38.86,5.72 27.81,16.76 v1(27.81,18.29) ; NOREF#14.TP2 27.81,35.81 v1(27.81,28.32)

## Copper pours and planes (outline as drawn; the poured copper is in the pictures)
GND on Top Layer: outline of 392 points within -160.75,-91.79 139.92,208.88
GND on Top Layer: outline of 368 points within -142.75,-72.9 131.32,201.17

## Text on the board
Top Silkscreen Layer: 1.Vcc5V | 3.VON | 10.VIN | 14.V01 | 19.GND | 220320726 / 彭尚品 / 2025/4/12

# Board PCB1_1
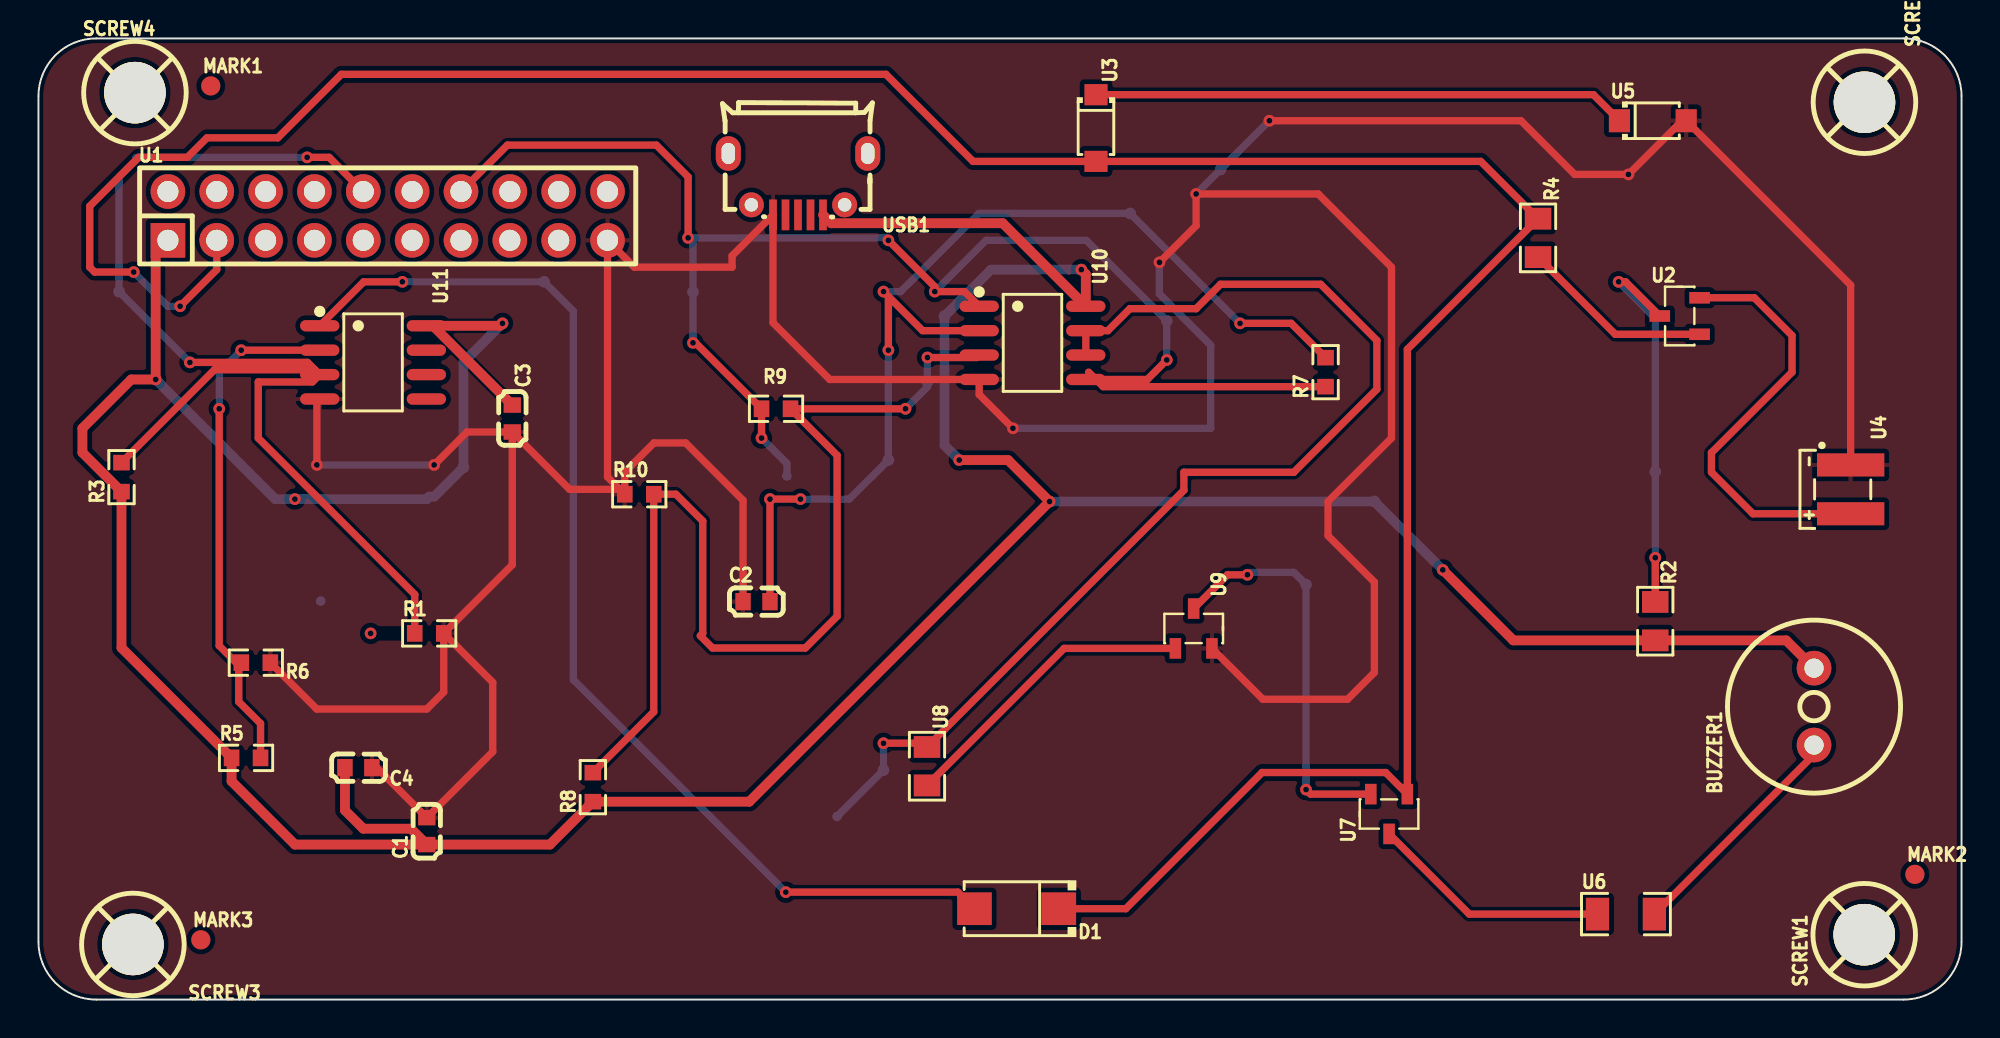
[diagram p3: board, top side]
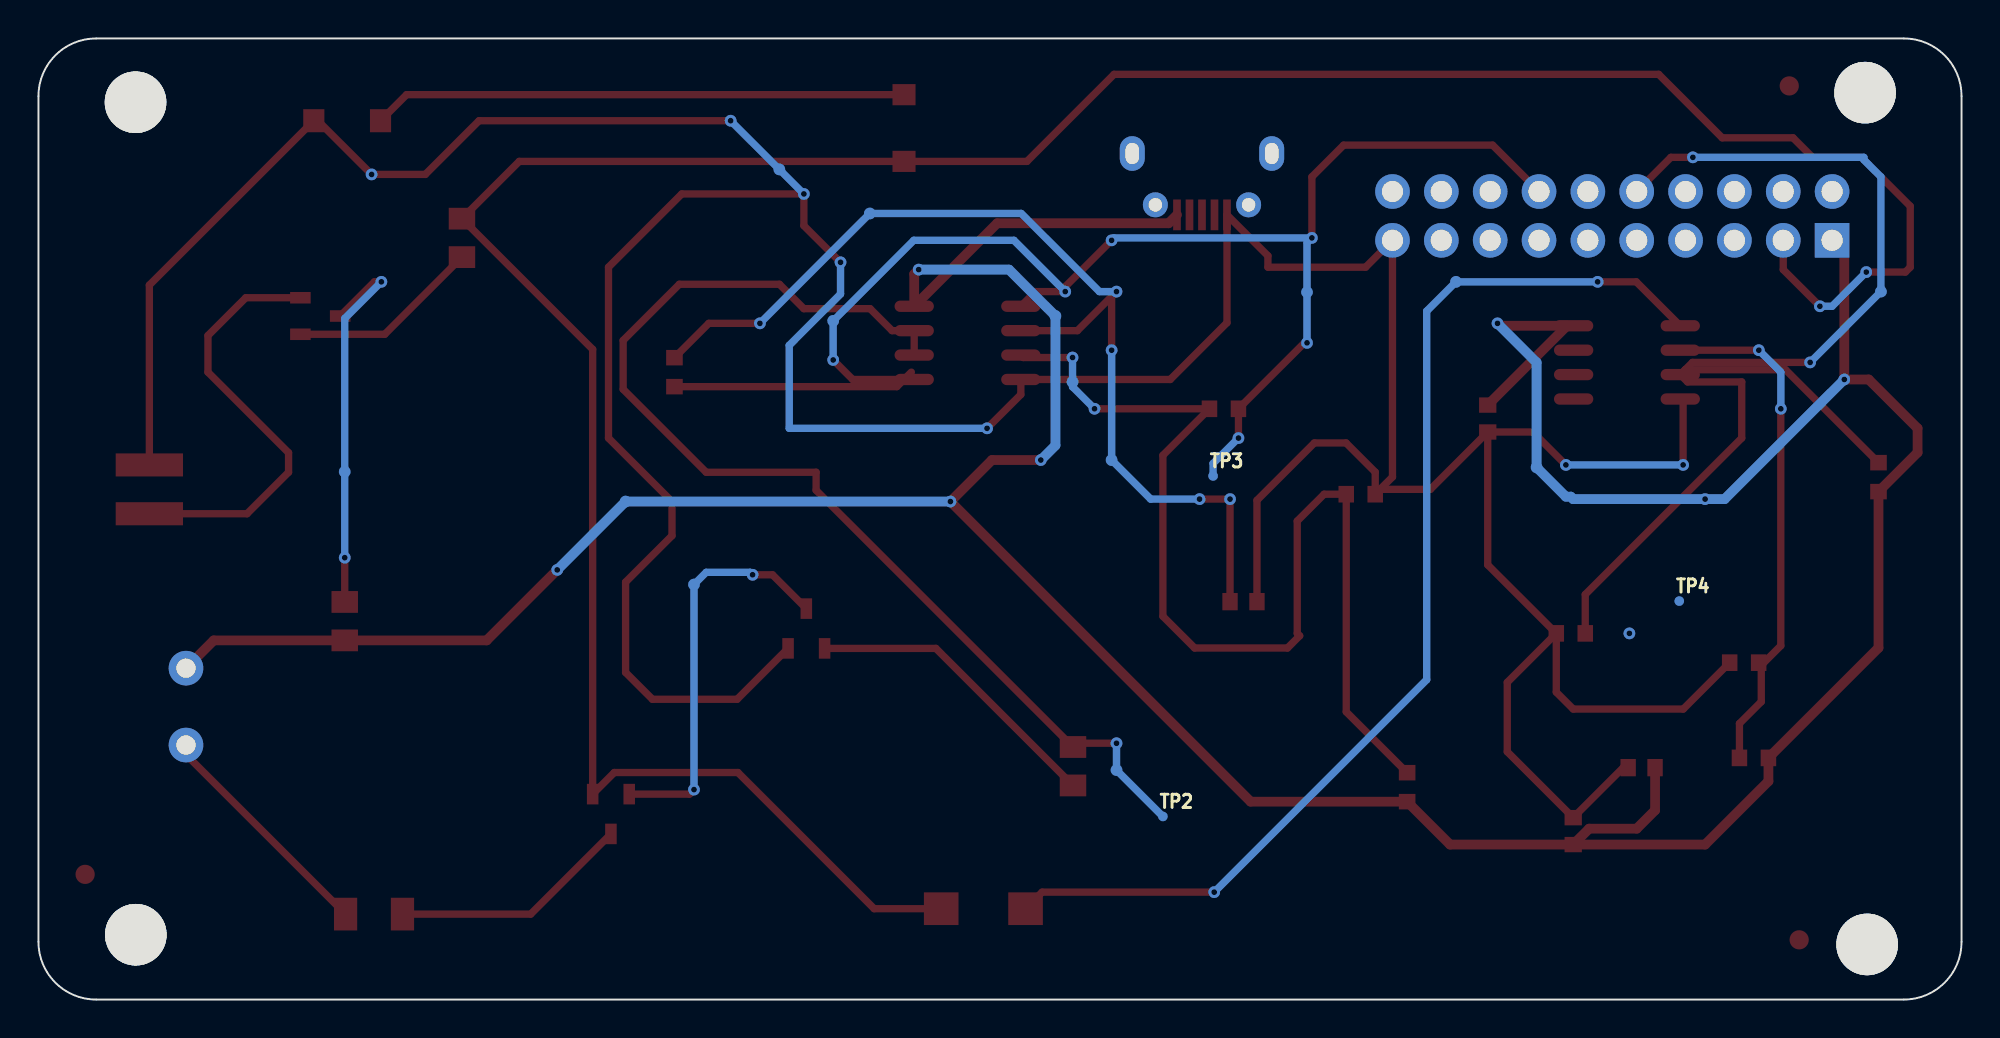
[diagram p4: board, bottom side, seen from below]

Outline 100 x 50 mm; copper layers: Top Layer, Bottom Layer. Coordinates in mm from the lower left corner of the outline.
Outline path: 0,47 0,3 arc(0.88,0.88) 3,0 97,0 arc(99.12,0.88) 100,3 100,47 arc(99.12,49.12) 97,50 3,50 arc(0.88,49.12) 0,47
Stack: Top Layer 0.035mm / Dielectric1 1.51mm FR4 er 4.5 / Bottom Layer 0.035mm

## Design rules (mm)
template: JLCPCB Capability(Two Layers Board)
spacing copperThickness1oz (default): track to track 0.102, other pairs 0.152 to 0.3
spacing copperThickness2oz: track to track 0.203, other pairs 0.152 to 0.3
track width copperThickness1oz (default): min 0.127, default 0.254, max 2.54
track width copperThickness2oz: min 0.203, default 0.254, max 2.54
differential pair differentialPair (default): width min 0.127, default 0.254, max 2.54; gap min 0.152, default 0.152
via viaSize (default): diameter min 0.5, default 0.61, max 10; hole min 0.3, default 0.305, max 6.3

## Placement (name value [footprint] x y rotation side)
BUZZER1  2.7kHz  [BUZ-TH_BD9.0-P4.00-D0.6-FD]  92.33 15.24 90 top
C1  100pF  [C0603]  20.19 8.76 90 top
C2  100pF  [C0603]  37.34 20.7 0 top
C3  100nF  [C0603]  24.64 30.23 270 top
C4  100nF  [C0603]  16.64 12.06 180 top
D1  1N5819  [SMA_L4.4-W2.6-LS5.0-RD]  50.86 4.73 180 top
MARK1  -  [Mark-Point-1mm]  8.96 47.53 0 top
MARK2  -  [Mark-Point-1mm]  97.57 6.51 0 top
MARK3  -  [Mark-Point-1mm]  8.44 3.11 0 top
NOREF  -  [Pad_e796]  69.47 25.91 0 top
NOREF#2  -  [Pad_e786]  22.1 27.69 0 top
NOREF#3  -  [Pad_e815]  43.94 11.94 0 top
NOREF#4  -  [Pad_e807]  47.12 35.56 0 top
NOREF#5  -  [Pad_e794]  44.2 28.07 0 top
NOREF#6  -  [Pad_e808]  46.23 32.13 0 top
NOREF#7  -  [Pad_e798]  84.07 27.46 0 top
NOREF#8  -  [Pad_e795]  58.67 35.31 0 top
NOREF#9  -  [Pad_e788]  34.04 36.8 0 top
NOREF#10  -  [Pad_e787]  56.77 40.89 0 top
NOREF#11  -  [Pad_e785]  26.29 37.34 0 top
NOREF#12  -  [Pad_e784]  4.19 36.83 0 top
NOREF#13  -  [Pad_e809]  61.47 43.19 0 top
NOREF#14  -  [Pad_e797]  65.91 21.59 0 top
R1  6.5kΩ  [R0603]  20.32 19.05 0 top
R2  90Ω  [R0805]  84.07 19.69 270 top
R3  NCP18XH103F03RB  [R0603]  4.32 27.18 90 top
R4  500Ω  [R0805]  77.98 39.62 270 top
R5  1.5kΩ  [R0603]  10.8 12.57 0 top
R6  1.5kΩ  [R0603]  11.3 17.53 180 top
R7  8.2kΩ  [R0603]  66.93 32.64 90 top
R8  150kΩ  [R0603]  28.83 11.05 90 top
R9  100kΩ  [R0603]  38.35 30.73 180 top
R10  100kΩ  [R0603]  31.24 26.29 0 top
SCREW1  -  [M3螺丝]  95 3.44 90 top
SCREW2  -  [M3螺丝]  94.89 46.62 270 top
SCREW3  -  [M3螺丝]  4.85 2.93 180 top
SCREW4  -  [M3螺丝]  5.08 47.12 0 top
TP2  -  [Test-Point-0.5mm]  41.53 9.53 180 bottom
TP3  -  [Test-Point-0.5mm]  38.92 27.24 180 bottom
TP4  -  [Test-Point-0.5mm]  14.68 20.73 180 bottom
U1  PM254-2-10-Z-8.5  [HDR-TH_20P-P2.54-V-F-R2-C10-S2.54]  18.16 40.77 0 top
U2  2N5551  [SOT-23-3_L2.9-W1.4-P1.90-LS2.5-BR]  85.34 35.56 0 top
U3  BZT52C18W  [SOD-123_L2.7-W1.6-LS3.8-RD]  54.99 45.34 270 top
U4  LS A676-P2S1-1-0-20-R33-Z  [LED-SMD_L4.0-W3.6-P2.54-RD]  94.23 26.54 270 top
U5  BZT52C18W  [SOD-123_L2.7-W1.6-LS3.8-RD]  83.95 45.72 0 top
U6  7.5Ω  [R1206]  82.55 4.45 0 top
U7  2N5551  [SOT-23-3_L2.9-W1.4-P1.90-LS2.5-BR]  70.23 9.65 90 top
U8  900Ω  [R0805]  46.2 12.14 270 top
U9  2N5551  [SOT-23-3_L2.9-W1.4-P1.90-LS2.5-BR]  60.07 19.3 270 top
U10  LM2904DR  [SOIC-8_L4.9-W3.9-P1.27-LS6.0-BL]  51.69 34.16 270 top
U11  LM2904DR  [SOIC-8_L4.9-W3.9-P1.27-LS6.0-BL]  17.4 33.15 270 top
USB1  MicroXNJ  [MICRO-USB-SMD_MICROXNJ]  39.5 42.42 180 top

## Footprints (pads in the part's own frame, mm; a bottom-side part is the same pattern mirrored in y, then rotated)
BUZ-TH_BD9.0-P4.00-D0.6-FD
  round 1.8 hole 1: 1(-2,0) 2(2,0)
C0603
  rect 0.8x0.9 smd: 1(-0.7,0) 2(0.7,0)
HDR-TH_20P-P2.54-V-F-R2-C10-S2.54
  rect 1.8x1.8 hole 1.1: 1(-11.43,-1.27)
  round 1.8 hole 1.1: 2(-11.43,1.27) 3(-8.89,-1.27) 4(-8.89,1.27) 5(-6.35,-1.27) 6(-6.35,1.27) 7(-3.81,-1.27) 8(-3.81,1.27) 9(-1.27,-1.27) 10(-1.27,1.27) 11(1.27,-1.27) 12(1.27,1.27) 13(3.81,-1.27) 14(3.81,1.27) 15(6.35,-1.27) 16(6.35,1.27) 17(8.89,-1.27) 18(8.89,1.27) 19(11.43,-1.27) 20(11.43,1.27)
LED-SMD_L4.0-W3.6-P2.54-RD
  rect 1.2x3.5 smd: 1(-1.27,0) 2(1.27,0)
M3螺丝
  round 3.2 hole 3.2: 1(-0.064,0.064)
Mark-Point-1mm
  round 1 smd: 1(0,0)
MICRO-USB-SMD_MICROXNJ
  rect 0.4x1.6 smd: 1(-1.3,1.597) 2(-0.65,1.597) 3(0,1.597) 4(0.65,1.597) 5(1.3,1.597)
  round 1.3 hole 0.7: 6(2.425,1.074) 9(-2.425,1.073)
  oval 1.3x1.8 hole 0.7x1.1: 7(3.625,-1.597) 8(-3.625,-1.597)
Pad_e784
  round 0.61 smd far side: TP1(0,0)
Pad_e785
  round 0.61 smd far side: TP2(0,0)
Pad_e786
  round 0.61 smd far side: TP3(0,0)
Pad_e787
  round 0.61 smd far side: TP4(0,0)
Pad_e788
  round 0.61 smd far side: TP5(0,0)
Pad_e794
  round 0.61 smd far side: TP6(0,0)
Pad_e795
  round 0.61 smd far side: TP7(0,0)
Pad_e796
  round 0.61 smd far side: TP8(0,0)
Pad_e797
  round 0.61 smd far side: TP9(0,0)
Pad_e798
  round 0.61 smd far side: TP10(0,0)
Pad_e807
  round 0.61 smd far side: TP11(0,0)
Pad_e808
  round 0.61 smd far side: TP12(0,0)
Pad_e809
  round 0.61 smd far side: TP13(0,0)
Pad_e815
  round 0.61 smd far side: TP14(0,0)
R0603
  rect 0.806x0.864 smd: 1(-0.753,0) 2(0.753,0)
R0805
  rect 1.133x1.377 smd: 1(-1,0) 2(1,0)
R1206
  rect 1.208x1.701 smd: 1(-1.479,0) 2(1.479,0)
SMA_L4.4-W2.6-LS5.0-RD
  rect 1.8x1.7 smd: 1(-2.192,0) 2(2.192,0)
SOD-123_L2.7-W1.6-LS3.8-RD
  rect 1.1x1.2 smd: 1(-1.735,0) 2(1.735,0)
SOIC-8_L4.9-W3.9-P1.27-LS6.0-BL
  oval 0.588x2.045 smd: 1(-1.905,-2.772) 2(-0.635,-2.772) 3(0.635,-2.772) 4(1.905,-2.772) 5(1.905,2.772) 6(0.635,2.772) 7(-0.635,2.772) 8(-1.905,2.772)
SOT-23-3_L2.9-W1.4-P1.90-LS2.5-BR
  rect 1.07x0.6 smd: 1(1.035,-0.95) 2(1.035,0.95) 3(-1.035,0)
Test-Point-0.5mm
  round 0.5 smd: 1(0,0)

## Nets
GND: C1.2 C2.1 C3.2 C4.1 NOREF#13.TP13 R1.2 R6.1 R10.1 U1.19 U4.1 U5.2 U9.2 U10.4 U11.4 USB1.5
VCC5V: BUZZER1.2 C1.1 C3.1 C4.2 NOREF.TP8 NOREF#2.TP3 NOREF#4.TP11 R2.2 R3.1 R5.1 R8.1 U1.1 U10.8 U11.8 USB1.1
VIN: NOREF#12.TP1 R1.1 R3.2 TP4.1 U1.10 U11.3
VO1: NOREF#8.TP7 NOREF#9.TP5 R7.1 R9.2 TP3.1 U1.14 U10.1 U10.5
VON: D1.1 R4.1 U1.3 U3.2 U7.1
$1N1134: U3.1 U5.1
$1N1559: R4.2 U2.1
$1N1638: U2.2 U4.2
$1N1768: NOREF#7.TP10 R2.1 U2.3
$1N1930: R5.2 R6.2 U11.2
$1N2911: NOREF#3.TP14 TP2.1 U8.1 U10.6 U10.7
$1N3068: NOREF#14.TP9 U7.2 U9.3
$1N3088: U6.1 U7.3
$1N3167: U8.2 U9.1
$1N3294: BUZZER1.1 U6.2
$1N3653: C2.2 NOREF#5.TP6 NOREF#10.TP4 R7.2 U10.2
$1N3786: NOREF#6.TP12 R8.2 R9.1 R10.2 U10.3
$1N4632: D1.2 NOREF#11.TP2 U11.1

Pads without a net: MARK1 1; MARK2 1; MARK3 1; SCREW1 1; SCREW2 1; SCREW3 1; SCREW4 1; U1 2 4 5 6 7 8 9 11 12 13 15 16 17 18 20; U11 5 6 7; USB1 2 3 4 6 7 8 9

## Via types
v1: diameter 0.61, hole 0.305, Top Layer to Bottom Layer, 41 vias

## Routing (per net, layer and track width the routed paths; a pad name or vN(x,y) marks a point on that pad's centre or on a via; arc(x,y) is an arc through that point)
GND: length 242.6
  Top Layer w0.381: R6.1 14.47,15.11 20.19,15.11 21.07,15.99 R1.2 ; C3.2 27.62,26.54 30.23,26.54 ; C3.2 24.64,22.61 R1.2 ; C3.2 22.29,29.53 v1(20.57,27.81) ; v1(64.01,45.72) 77.09,45.72 79.88,42.93 v1(82.68,42.93) 85.47,45.72 U5.2 94.23,37.17 U4.1 ; v1(14.48,27.81) 14.48,31.09 U11.4 ; U9.2 63.67,15.62 68.07,15.62 69.47,17.02 69.47,21.72 67.06,24.13 67.06,25.91 70.36,29.21 70.36,38.1 66.55,41.91 v1(60.2,41.91) 60.2,40.26 v1(58.29,38.35) ; R1.2 23.62,16.5 23.62,12.89 C1.2 17.59,12.06 C4.1 ; 30.23,26.54 R10.1 30.49,27.44 32,28.96 33.65,28.96 36.64,25.97 36.64,20.7 ; 30.23,26.54 29.59,27.19 U1.19 30.99,38.1 36.07,38.1 36.07,38.69 USB1.5 38.2,35.21 41.15,32.26 U10.4 48.92,31.47 v1(50.67,29.72)
  Bottom Layer w0.381: v1(60.2,41.91) NOREF#13.TP13 v1(64.01,45.72) ; v1(58.29,38.35) 58.29,36.7 60.96,34.04 60.96,29.72 v1(50.67,29.72) ; v1(20.57,27.81) v1(14.48,27.81)
VCC5V: length 211.2
  Top Layer w0.381: 20.51,35.05 U11.8
  Top Layer w0.508: C1.1 19.37,8.89 16.89,8.89 15.94,9.84 C4.2 ; C1.1 26.6,8.06 R8.1 36.97,10.3 v1(52.58,25.91) 50.42,28.07 v1(47.88,28.07) ; C1.1 13.33,8.06 10.04,11.36 R5.1 4.32,18.3 R3.1 2.29,28.46 2.29,29.72 4.83,32.26 v1(6.1,32.26) 6.1,38.61 ; v1(24.13,35.18) 24,35.05 20.51,35.05 C3.1 ; USB1.1 41.23,40.39 50.14,40.39 U10.8 54.46,37.74 v1(54.23,37.97) ; BUZZER1.2 90.88,18.69 R2.2 76.69,18.69 v1(73.02,22.35)
  Bottom Layer w0.508: v1(6.1,32.26) 12.32,26.03 v1(13.33,26.03) 20.19,26.03 20.32,26.16 20.57,26.16 NOREF#2.TP3 22.1,33.15 v1(24.13,35.18) ; v1(47.88,28.07) 47.12,28.83 NOREF#4.TP11 49.53,37.97 v1(54.23,37.97) ; v1(52.58,25.91) NOREF.TP8 v1(73.02,22.35)
VIN: length 64
  Top Layer w0.381: R1.1 19.57,21.07 11.43,29.21 11.43,32.13 14.25,32.13 U11.3 14.37,32.77 ; 14.37,32.77 9.15,32.77 R3.2 ; 14.37,32.77 13.99,33.15 v1(7.87,33.15) ; v1(13.97,43.81) 15.11,43.81 U1.10
  Bottom Layer w0.381: v1(13.97,43.81) 5.08,43.81 5.08,43.69 4.19,42.8 NOREF#12.TP1 v1(7.87,33.15)
  vias: v1(17.27,19.05)
VO1: length 82.2
  Top Layer w0.381: v1(34.04,34.16) 34.17,34.16 R9.2 v1(37.6,29.21) ; v1(58.67,33.27) 57.66,32.26 54.99,32.26 ; U10.5 54.99,32.26 ; 54.99,32.26 55.36,31.89 R7.1 ; 54.99,32.26 54.61,32.64 ; U1.14 24.38,44.45 32.13,44.45 33.78,42.8 v1(33.78,39.62) ; v1(44.2,39.5) 46.61,37.08 v1(46.61,36.83) 48.15,36.83 U10.1
  Bottom Layer w0.381: TP3.1 38.92,27.89 v1(37.6,29.21) ; v1(46.61,36.83) 49.28,39.5 54.48,39.5 NOREF#8.TP7 v1(58.67,33.27) ; v1(44.2,39.5) 44.07,39.62 v1(33.78,39.62) 34.04,39.37 NOREF#9.TP5 v1(34.04,34.16)
VON: length 148.5
  Top Layer w0.381: v1(4.95,37.85) 2.92,37.85 2.67,38.1 2.67,41.28 5.21,43.81 7.75,43.81 8.76,44.83 12.45,44.83 15.75,48.13 44.07,48.13 48.6,43.6 U3.2 75,43.6 R4.1 71.18,33.83 U7.1 70.06,11.81 63.63,11.81 56.54,4.73 D1.1 ; v1(7.37,36.07) 9.27,37.97 U1.3
  Bottom Layer w0.381: v1(7.37,36.07) 6.73,36.07 v1(4.95,37.85)
$1N1134: length 27.8
  Top Layer w0.381: U3.1 80.86,47.07 82.21,45.72
$1N1559: length 10.1
  Top Layer w0.381: U2.1 81.99,34.61 R4.2
$1N1638: length 22.6
  Top Layer w0.381: U2.2 89.22,36.51 91.19,34.54 91.19,32.64 86.99,28.45 86.99,27.43 89.15,25.27 U4.2
$1N1768: length 20.3
  Top Layer w0.381: R2.1 v1(84.07,22.99) ; U2.3 82.53,37.34 v1(82.17,37.34)
  Bottom Layer w0.381: v1(84.07,22.99) NOREF#7.TP10 84.07,35.43 v1(82.17,37.34)
$1N1930: length 26.9
  Top Layer w0.381: 10.41,17.39 10.41,15.49 11.55,14.36 R5.2 ; 10.41,17.39 R6.2 ; 10.41,17.39 9.4,18.41 v1(9.4,30.73) ; v1(10.54,33.78) 14.63,33.78
  Bottom Layer w0.381: v1(9.4,30.73) 9.4,32.64 v1(10.54,33.78)
$1N2911: length 60
  Top Layer w0.381: v1(43.94,13.34) 46.01,13.34 U8.1 59.56,26.5 59.56,27.43 65.28,27.43 69.6,31.75 69.6,34.29 66.67,37.21 61.47,37.21 60.2,35.94 56.75,35.94 55.61,34.8 U10.7 54.46,33.53
  Bottom Layer w0.381: TP2.1 NOREF#3.TP14 v1(43.94,13.34)
$1N3068: length 21
  Top Layer w0.381: U7.2 66.15,10.69 v1(65.91,10.92) ; U9.3 61.83,22.1 v1(62.86,22.1)
  Bottom Layer w0.381: v1(65.91,10.92) NOREF#14.TP9 65.28,22.22 62.99,22.22 v1(62.86,22.1)
$1N3088: length 12.6
  Top Layer w0.381: U6.1 74.4,4.45 U7.3
$1N3167: length 15.9
  Top Layer w0.381: U8.2 53.33,18.27 U9.1
$1N3294: length 12.2
  Top Layer w0.381: U6.2 92.33,12.75 BUZZER1.1
$1N3653: length 54.4
  Top Layer w0.381: v1(62.48,35.18) 65.14,35.18 R7.2 ; U10.2 45.97,34.8 44.2,36.58 ; 44.2,36.58 v1(43.94,36.83) ; 44.2,36.58 v1(44.2,33.78) ; C2.2 v1(38.04,26.03) v1(39.62,26.03)
  Bottom Layer w0.381: v1(43.94,36.83) 44.83,36.83 48.89,40.89 NOREF#10.TP4 v1(62.48,35.18) ; v1(44.2,33.78) NOREF#5.TP6 42.16,26.03 v1(39.62,26.03)
$1N3786: length 56.7
  Top Layer w0.381: v1(45.08,30.73) R9.1 41.53,28.31 41.53,19.94 39.88,18.29 35.05,18.29 34.42,18.92 34.54,19.05 34.54,24.89 33.15,26.29 R10.2 32,14.97 R8.2 ; v1(46.23,33.4) 48.79,33.4 48.92,33.53
  Bottom Layer w0.381: v1(45.08,30.73) 46.23,31.88 v1(46.23,33.4)
$1N4632: length 59.7
  Top Layer w0.381: D1.2 47.81,5.59 v1(38.86,5.59) ; U11.1 16.91,37.34 v1(18.92,37.34)
  Bottom Layer w0.381: v1(18.92,37.34) NOREF#11.TP2 27.81,35.81 27.81,16.64 v1(38.86,5.59)

## Copper pours and planes (outline as drawn; the poured copper is in the pictures)
GND on Top Layer: -16.89,61.59 102.49,61.59 102.49,-14.1 -16.89,-14.1
GND on Top Layer: -1.02,50.67 101.35,50.67 101.35,-0.76 -1.02,-0.76
